# EAGLE schematic WaveTable (EAGLE 9.0.1)
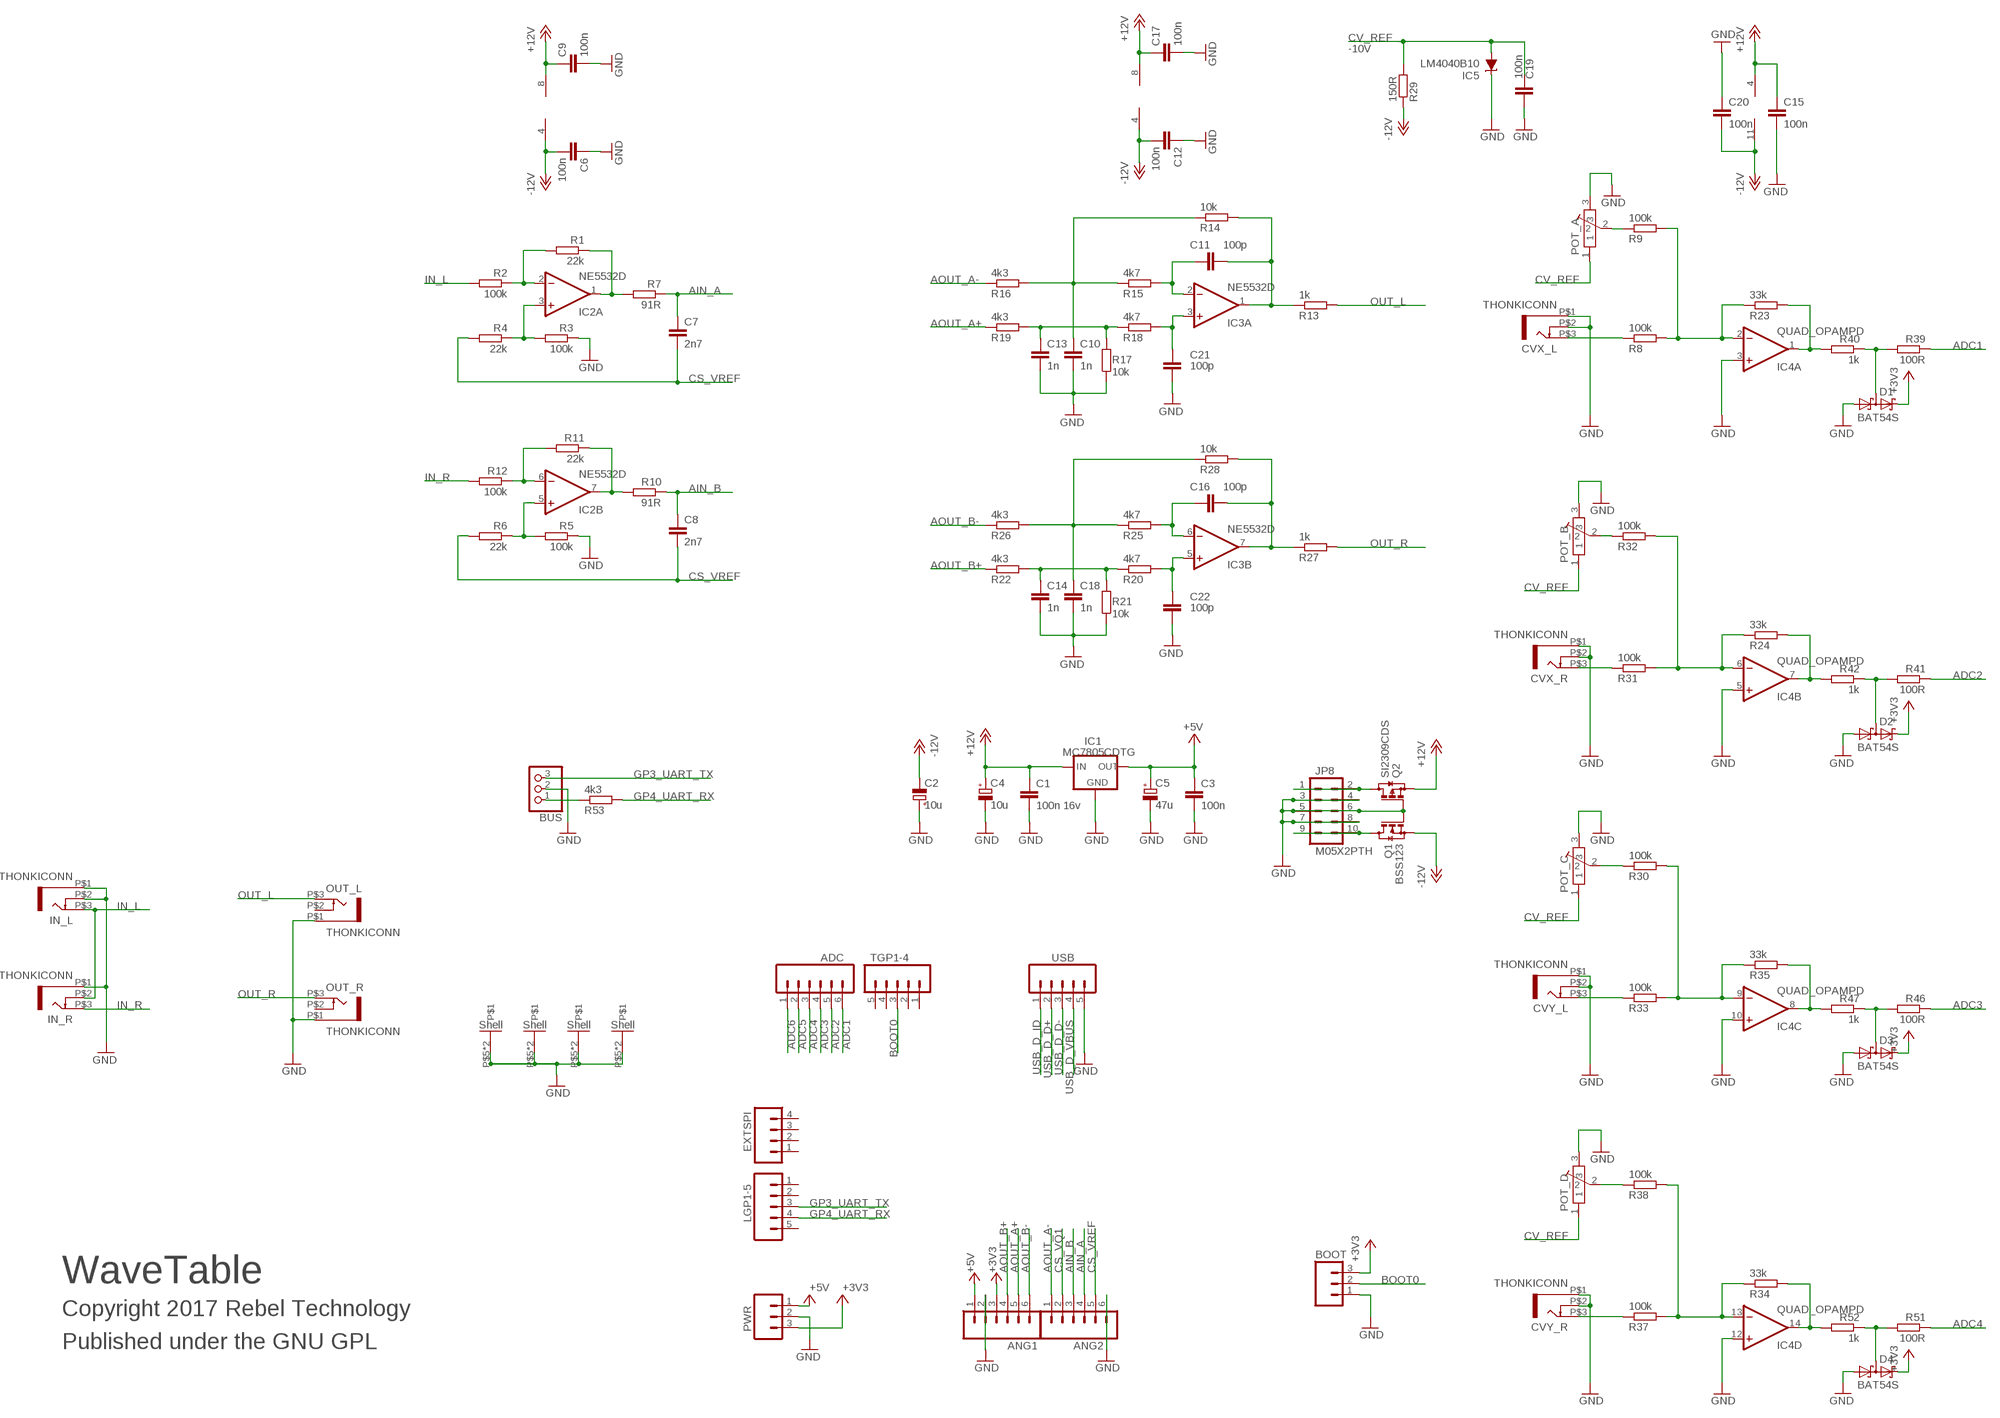
[diagram p0: schematic, sheet 1, part 1 of 2]
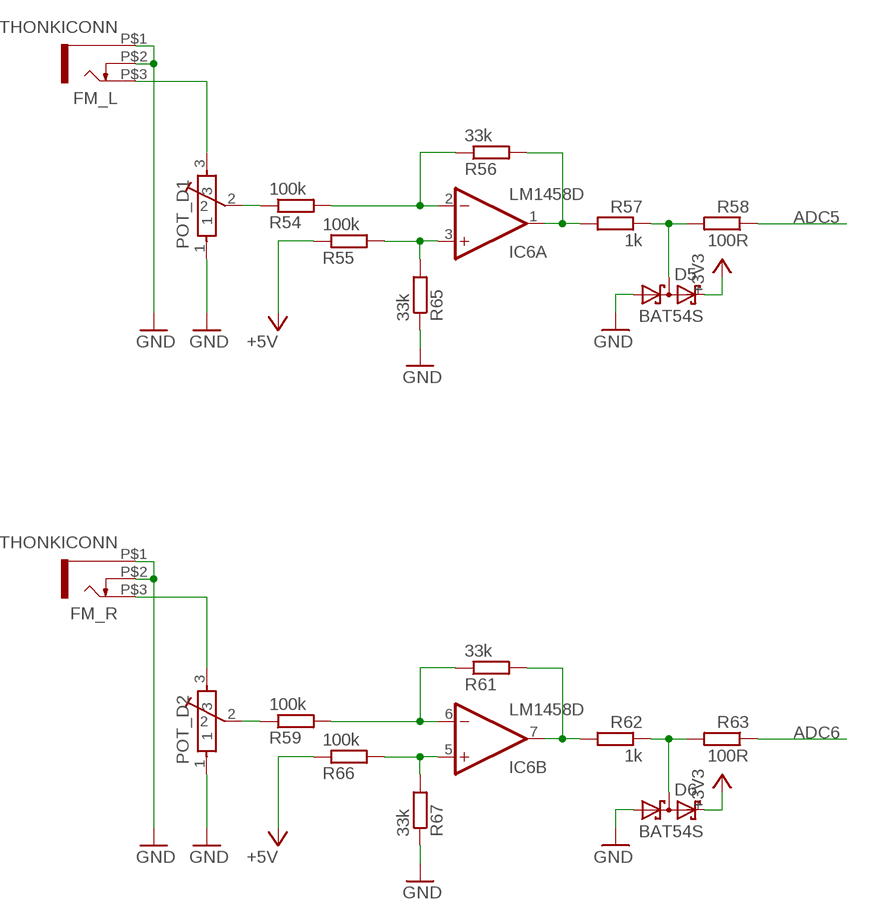
[diagram p1: schematic, sheet 1, part 2 of 2]

## Parts
ADC  M06SIP  [1X06]
ANG1  M06SIP  [1X06]
ANG2  M06SIP  [1X06]
BOOT  M03PTH  [1X03]
BUS  CON-JST-1X03PH-TH  [JST-B3B-PH-KL]
C1  100n 16v  C-EUC0603  [C0603]
C2  10u  CPOL-EU153CLV-0505  [CPOL-5]
C3  100n  C-EUC0603  [C0603]
C4  10u  CPOL-EU153CLV-0505  [CPOL-5]
C5  47u  CPOL-EUC  [PANASONIC_C]
C6  100n  C-EUC0603  [C0603]
C7  2n7  C-EUC0603  [C0603]
C8  2n7  C-EUC0603  [C0603]
C9  100n  C-EUC0603  [C0603]
C10  1n  C-EUC0603  [C0603]
C11  100p  C-EUC0603  [C0603]
C12  100n  C-EUC0603  [C0603]
C13  1n  C-EUC0603  [C0603]
C14  1n  C-EUC0603  [C0603]
C15  100n  C-EUC0603  [C0603]
C16  100p  C-EUC0603  [C0603]
C17  100n  C-EUC0603  [C0603]
C18  1n  C-EUC0603  [C0603]
C19  100n  C-EUC0603  [C0603]
C20  100n  C-EUC0603  [C0603]
C21  100p  C-EUC0603  [C0603]
C22  100p  C-EUC0603  [C0603]
CVX_L  THONKICONN  [THONKICONN]
CVX_R  THONKICONN  [THONKICONN]
CVY_L  THONKICONN  [THONKICONN]
CVY_R  THONKICONN  [THONKICONN]
D1  BAT54S  [SOT23]
D2  BAT54S  [SOT23]
D3  BAT54S  [SOT23]
D4  BAT54S  [SOT23]
D5  BAT54S  [SOT23]
D6  BAT54S  [SOT23]
EXTSPI  M04PTH  [1X04]
FM_L  THONKICONN  [THONKICONN]
FM_R  THONKICONN  [THONKICONN]
IC1  MC7805CDTG  MC78XX  [DPACK]
IC2  NE5532D  [SO08]
IC3  NE5532D  [SO08]
IC4  QUAD_OPAMPD  [SO14]
IC5  LM4040B10  LM4041C12DBZ  [DBZ_R-PDSO-G3]
IC6  LM1458D  [SO08]
IN_L  THONKICONN  [THONKICONN]
IN_R  THONKICONN  [THONKICONN]
JP8  M05X2PTH  [AVR_ICSP]
LGP1-5  M05PTH  [1X05]
OUT_L  THONKICONN  [THONKICONN]
OUT_R  THONKICONN  [THONKICONN]
POT_A  POT-ALPS-RK09L1140  [POT-ALPS-RK09L1140]
POT_B  POT-ALPS-RK09L1140  [POT-ALPS-RK09L1140]
POT_C  POT-ALPS-RK09L1140  [POT-ALPS-RK09L1140]
POT_D  POT-ALPS-RK09L1140  [POT-ALPS-RK09L1140]
POT_D1  POT-ALPS-RK09L1140  [POT-ALPS-RK09L1140]
POT_D2  POT-ALPS-RK09L1140  [POT-ALPS-RK09L1140]
PWR  M03PTH  [1X03]
Q1  BSS123  [SOT23]
Q2  SI2309CDS  BSS84  [SOT23]
R1  22k  R-EU_0603  [0603]
R2  100k  R-EU_0603  [0603]
R3  100k  R-EU_0603  [0603]
R4  22k  R-EU_0603  [0603]
R5  100k  R-EU_0603  [0603]
R6  22k  R-EU_0603  [0603]
R7  91R  R-EU_0603  [0603]
R8  100k  R-EU_0603  [0603]
R9  100k  R-EU_0603  [0603]
R10  91R  R-EU_0603  [0603]
R11  22k  R-EU_0603  [0603]
R12  100k  R-EU_0603  [0603]
R13  1k  R-EU_0603  [0603]
R14  10k  R-EU_0603  [0603]
R15  4k7  R-EU_0603  [0603]
R16  4k3  R-EU_0603  [0603]
R17  10k  R-EU_0603  [0603]
R18  4k7  R-EU_0603  [0603]
R19  4k3  R-EU_0603  [0603]
R20  4k7  R-EU_0603  [0603]
R21  10k  R-EU_0603  [0603]
R22  4k3  R-EU_0603  [0603]
R23  33k  R-EU_0603  [0603]
R24  33k  R-EU_0603  [0603]
R25  4k7  R-EU_0603  [0603]
R26  4k3  R-EU_0603  [0603]
R27  1k  R-EU_0603  [0603]
R28  10k  R-EU_0603  [0603]
R29  150R  R-EU_0603  [0603]
R30  100k  R-EU_0603  [0603]
R31  100k  R-EU_0603  [0603]
R32  100k  R-EU_0603  [0603]
R33  100k  R-EU_0603  [0603]
R34  33k  R-EU_0603  [0603]
R35  33k  R-EU_0603  [0603]
R37  100k  R-EU_0603  [0603]
R38  100k  R-EU_0603  [0603]
R39  100R  R-EU_0603  [0603]
R40  1k  R-EU_0603  [0603]
R41  100R  R-EU_0603  [0603]
R42  1k  R-EU_0603  [0603]
R46  100R  R-EU_0603  [0603]
R47  1k  R-EU_0603  [0603]
R51  100R  R-EU_0603  [0603]
R52  1k  R-EU_0603  [0603]
R53  4k3  R-EU_0603  [0603]
R54  100k  R-EU_0603  [0603]
R55  100k  R-EU_0603  [0603]
R56  33k  R-EU_0603  [0603]
R57  1k  R-EU_0603  [0603]
R58  100R  R-EU_0603  [0603]
R59  100k  R-EU_0603  [0603]
R61  33k  R-EU_0603  [0603]
R62  1k  R-EU_0603  [0603]
R63  100R  R-EU_0603  [0603]
R65  33k  R-EU_0603  [0603]
R66  100k  R-EU_0603  [0603]
R67  33k  R-EU_0603  [0603]
TGP1-4  M05PTH  [1X05]
USB  M05PTH  [1X05]

## Nets
+3V3: ANG1.3 BOOT.3 D1.2(C2) D2.2(C2) D3.2(C2) D4.2(C2) D5.2(C2) D6.2(C2) PWR.3
+5V: ANG1.1 C3.1 C5.+ IC1.3(OUT) PWR.1 R55.1 R66.1
+12V: C1.1 C4.+ C9.1 C15.1 C17.1 IC1.1(IN) IC2.8(P:V+) IC3.8(P:V+) IC4.4(P:V+) Q2.2(S)
-12V: C2.- C6.2 C12.2 C20.2 IC2.4(P:V-) IC3.4(P:V-) IC4.11(P:V-) Q1.2(S) R29.1
ADC1: ADC.6 R39.1
ADC2: ADC.5 R41.1
ADC3: ADC.4 R46.1
ADC4: ADC.3 R51.1
ADC5: ADC.2 R58.1
ADC6: ADC.1 R63.1
AIN_A: ANG2.4 C7.1 R7.1
AIN_B: ANG2.3 C8.1 R10.1
AOUT_A+: ANG1.5 R19.1
AOUT_A-: ANG2.1 R16.1
AOUT_B+: ANG1.4 R22.1
AOUT_B-: ANG1.6 R26.1
BOOT0: BOOT.2 TGP1-4.3
CS_VQ1: ANG2.2
CS_VREF: ANG2.5 C7.2 C8.2 R4.2 R6.2
CV_REF: C19.1 IC5.2(A) POT_A.1 POT_B.1 POT_C.1 POT_D.1 R29.2
EXT_UART_RX: BUS.1 R53.1
GND: ANG1.2 ANG2.6 BOOT.1 BUS.2 C1.2 C2.+ C3.2 C4.- C5.- C6.1 C9.2 C10.2 C12.1 C13.2 C14.2 C15.2 C17.2 C18.2 C19.2 C20.1 C21.2 C22.2 CVX_L.P$1 CVX_L.P$2 CVX_R.P$1 CVX_R.P$2 CVY_L.P$1 CVY_L.P$2 CVY_R.P$1 CVY_R.P$2 D1.1(A1) D2.1(A1) D3.1(A1) D4.1(A1) D5.1(A1) D6.1(A1) FM_L.P$1 FM_L.P$2 FM_R.P$1 FM_R.P$2 IC1.4(GND) IC4.3(A:+IN) IC4.5(B:+IN) IC4.10(C:+IN) IC4.12(D:+IN) IC5.1(C) IN_L.P$1 IN_L.P$2 IN_R.P$1 JP8.3 JP8.4 JP8.5 JP8.6 JP8.7 JP8.8 OUT_L.P$1 OUT_R.P$1 POT_A.3 POT_A.P$5 POT_A.P$6 POT_B.3 POT_B.P$5 POT_B.P$6 POT_C.3 POT_C.P$5 POT_C.P$6 POT_D1.1 POT_D2.1 POT_D.3 POT_D.P$5 POT_D.P$6 PWR.2 Q1.1(G) Q2.1(G) R3.1 R5.1 R17.1 R21.1 R65.1 R67.1 USB.5
GP3_UART_TX: BUS.3 LGP1-5.3
GP4_UART_RX: LGP1-5.4 R53.2
IN_L: IN_L.P$3 IN_R.P$2 R2.2
IN_R: IN_R.P$3 R12.2
N$1: IC2.1(A:OUT) R1.1 R7.2
N$2: IC2.3(A:+IN) R3.2 R4.1
N$3: CVX_L.P$3 R8.1
N$4: IC2.5(B:+IN) R5.2 R6.1
N$5: IC2.6(B:-IN) R11.2 R12.1
N$6: IC4.9(C:-IN) R30.2 R33.2 R35.1
N$7: C11.1 IC3.2(A:-IN) R15.2
N$8: JP8.9 JP8.10 Q1.3(D)
N$9: IC2.2(A:-IN) R1.2 R2.1
N$10: IC2.7(B:OUT) R10.2 R11.1
N$11: C21.1 IC3.3(A:+IN) R18.2
N$12: JP8.1 JP8.2 Q2.3(D)
N$13: IC4.2(A:-IN) R8.2 R9.2 R23.1
N$14: POT_A.2 R9.1
N$15: C13.1 R17.2 R18.1 R19.2
N$16: D1.3(C1A2) R39.2 R40.1
N$17: IC4.1(A:OUT) R23.2 R40.2
N$18: C16.2 IC3.7(B:OUT) R27.1 R28.2
N$19: CVX_R.P$3 R31.1
N$20: IC4.6(B:-IN) R24.1 R31.2 R32.2
N$21: POT_B.2 R32.1
N$22: IC4.7(B:OUT) R24.2 R42.2
N$23: D2.3(C1A2) R41.2 R42.1
N$24: C18.1 R25.1 R26.2 R28.1
N$25: CVY_L.P$3 R33.1
N$26: C16.1 IC3.6(B:-IN) R25.2
N$27: POT_C.2 R30.1
N$28: IC4.8(C:OUT) R35.2 R47.2
N$29: D3.3(C1A2) R46.2 R47.1
N$30: C22.1 IC3.5(B:+IN) R20.2
N$31: CVY_R.P$3 R37.1
N$32: C14.1 R20.1 R21.2 R22.2
N$33: IC4.13(D:-IN) R34.1 R37.2 R38.2
N$34: POT_D.2 R38.1
N$35: IC4.14(D:OUT) R34.2 R52.2
N$36: D4.3(C1A2) R51.2 R52.1
N$39: C11.2 IC3.1(A:OUT) R13.1 R14.2
N$41: C10.1 R14.1 R15.1 R16.2
N$45: POT_D1.2 R54.1
N$47: IC6.1(A:OUT) R56.2 R57.2
N$48: D5.3(C1A2) R57.1 R58.2
N$49: POT_D2.2 R59.1
N$50: IC6.6(B:-IN) R59.2 R61.1
N$51: FM_R.P$3 POT_D2.3
N$52: IC6.7(B:OUT) R61.2 R62.2
N$53: D6.3(C1A2) R62.1 R63.2
N$54: IC6.2(A:-IN) R54.2 R56.1
N$55: IC6.3(A:+IN) R55.2 R65.2
N$56: IC6.5(B:+IN) R66.2 R67.2
N$57: FM_L.P$3 POT_D1.3
OUT_L: OUT_L.P$3 R13.2
OUT_R: OUT_R.P$3 R27.2
USB_D_D+: USB.2
USB_D_D-: USB.3
USB_D_ID: USB.1
USB_D_VBUS: USB.4
Unconnected: EXTSPI.1 EXTSPI.2 EXTSPI.3 EXTSPI.4 LGP1-5.1 LGP1-5.2 LGP1-5.5 OUT_L.P$2 OUT_R.P$2 POT_D1.P$5 POT_D1.P$6 POT_D2.P$5 POT_D2.P$6 TGP1-4.1 TGP1-4.2 TGP1-4.4 TGP1-4.5

## Notes on the sheet
- -10V
- WaveTable
- Copyright 2017 Rebel Technology
- Published under the GNU GPL

## Power pins joined to a net without a drawn wire
V+: IC6.8(P:V+)
V-: IC6.4(P:V-)

## Library data of the parts
ADC ANG1 ANG2 = SparkFun:M06: Header 6 Standard 6-pin 0.1" header. Use with straight break away headers (SKU : PRT-00116), right angle break away headers (PRT-00553), swiss pins (PRT-00743), machine pins (PRT-00117), and female headers (PRT-00115). Molex polarized connector foot print use with SKU : PRT-08094 with associated crimp pins and housings. NOTES ON THE VARIANTS LOCK and LOCK_LONGPADS... This footprint was designed to help hold the alignment of a through-hole component (i.e. 6-pin header) while soldering it into place. You may notice that each hole has been shifted either up or down by 0.005 of an inch from it's more standard position (which is a perfectly straight line). This slight alteration caused the pins (the squares in the middle) to touch the edges of the holes. Because they are alternating, it causes a "brace" to hold the component in place. 0.005 has proven to be the perfect amount of "off-center" position when using our standard breakaway headers. Although looks a little odd when you look at the bare footprint, once you have a header in there, the alteration is very hard to notice. Also, if you push a header all the way into place, it is covered up entirely on the bottom side. This idea of altering the position of holes to aid alignment will be further integrated into the Sparkfun Library for other footprints. It can help hold any component with 3 or more connection pins.
BOOT PWR = SparkFun:M03: Header 3 Standard 3-pin 0.1" header. Use with straight break away headers (SKU : PRT-00116), right angle break away headers (PRT-00553), swiss pins (PRT-00743), machine pins (PRT-00117), and female headers (PRT-00115). Molex polarized connector foot print use with SKU : PRT-08232 with associated crimp pins and housings.
BUS = Rebel:CON-JST-1X03
C1 C3 = Rebel:C-EU: CAPACITOR, European symbol
C2 C4 = Rebel:CPOL-EU: POLARIZED CAPACITOR, European symbol
C5 = rcl:CPOL-EU: POLARIZED CAPACITOR, European symbol
C6-C22 = resistor:C-EU: CAPACITOR, European symbol
CVX_L CVX_R CVY_L CVY_R FM_L FM_R IN_L IN_R OUT_L OUT_R = Rebel:THONKICONN
D1-D6 = diode:BAT54S: Schottky Diodes Pin connection corrected 2011-05-04 Source: Fairchild .. BAT54.pdf
EXTSPI = SparkFun:M04: Header 4 Standard 4-pin 0.1" header. Use with straight break away headers (SKU : PRT-00116), right angle break away headers (PRT-00553), swiss pins (PRT-00743), machine pins (PRT-00117), and female headers (PRT-00115). Molex polarized connector foot print use with SKU : PRT-08231 with associated crimp pins and housings. 1MM SMD Version SKU: PRT-10208
IC1 = James:MC78XX: VOLTAGE REGULATOR; OC_FARNELL: 2296028
IC2 IC3 = linear:NE5532: AUDIO AMPLIFIER
IC4 = adafruit:QUAD_OPAMP: OP AMP Standard quad package
IC5 = texas:LM4041: PRECISION MICROPOWER SHUNT VOLTAGE REFERENCE Source: http://focus.ti.com/lit/ds/slcs146e/slcs146e.pdf; MF: TEXAS INSTRUMENT CONNECTORS; MPN: LM4041C12QDBZT; OC_FARNELL: 1771733; OC_NEWARK: 43K3376
IC6 = linear:*1458: OP AMP
JP8 = SparkFun:M05X2: Header 5x2 Standard 10-pin dual row 0.1" header. Commonly used with AVR-ISP. Use with Spark Fun Electronics SKU: PRT-00778
LGP1-5 TGP1-4 USB = SparkFun:M05: Header 5 Standard 5-pin 0.1" header. Use with straight break away headers (SKU : PRT-00116), right angle break away headers (PRT-00553), swiss pins (PRT-00743), machine pins (PRT-00117), and female headers (PRT-00115). Molex polarized connector foot print use with SKU : PRT-08230 with associated crimp pins and housings.
POT_A POT_B POT_C POT_D POT_D1 POT_D2 = Rebel:POT-ALPS-RK09L
Q1 = transistor-small-signal:BSS123: N-CHANNEL MOS FET; OC_FARNELL: 1843725
Q2 = transistor-small-signal:BSS84: P-CHANNEL MOS FET; OC_FARNELL: 1779264
R1-R35 R37-R42 R46 R47 R51-R59 R61-R63 R65-R67 = Rebel:R-EU_: RESISTOR, European symbol

## Net classes
1 power: width 0.178 mm, drill 0.305 mm, clearance 0.178 mm to class 0, clearance 0.178 mm